# EAGLE schematic smps schematic (EAGLE 9.6.2)
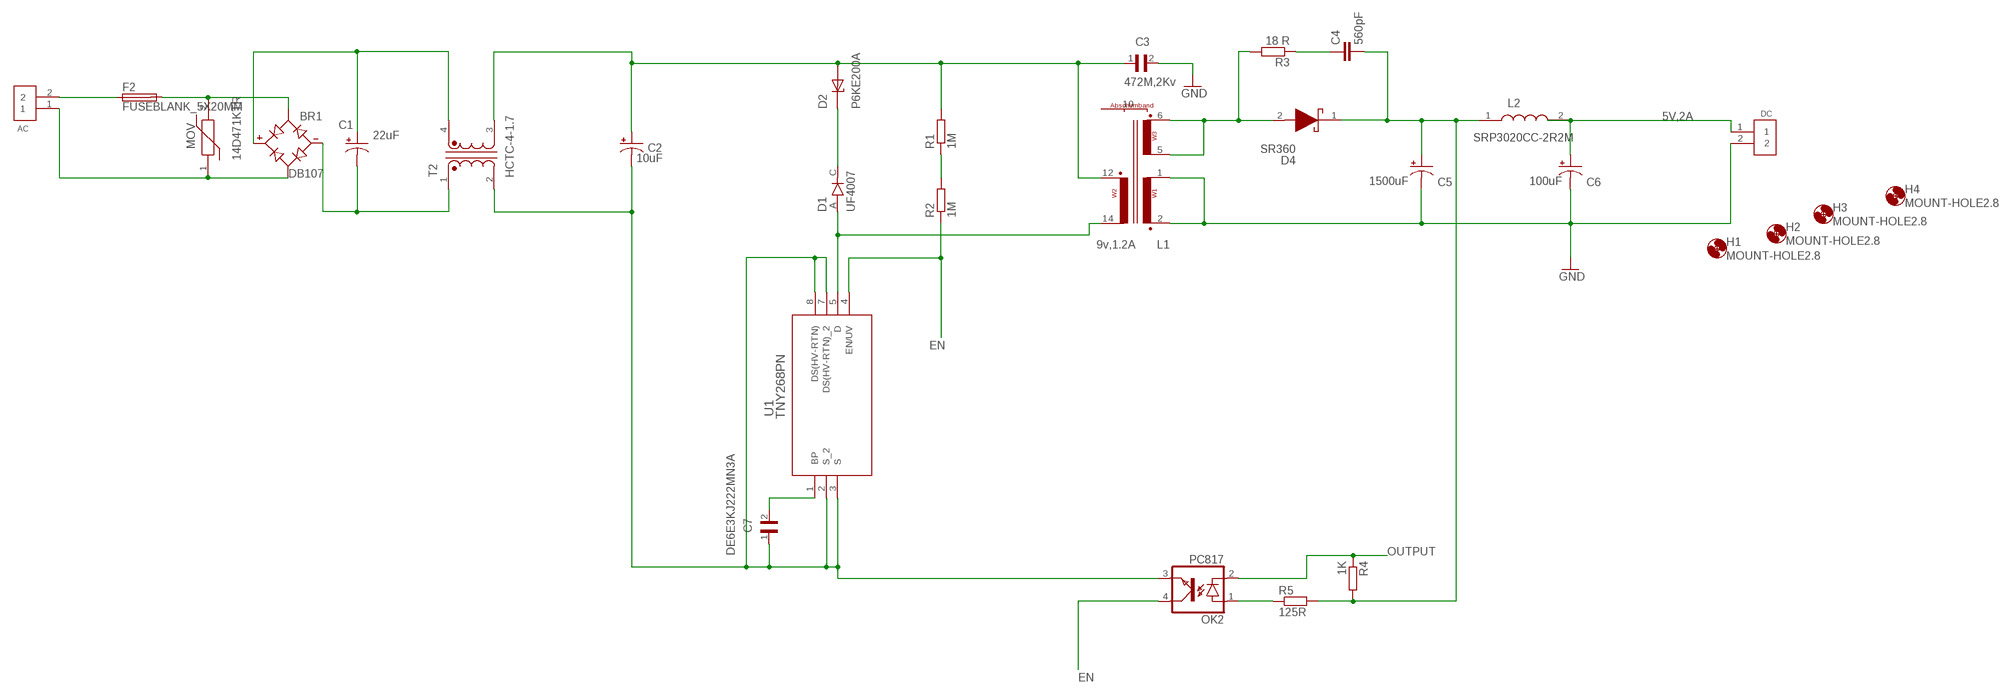
[diagram p0: schematic, sheet 1]

## Parts
AC  282837-2  [TE_282837-2]
BR1  DB107  [DIP825W50P509L880H320Q4]
C1  22uF  1F-2.7V(PTH)CPOL-RADIAL-1H-2.7V  [CPOL-RADIAL-1F-2.7V]
C2  10uF  1F-2.7V(PTH)CPOL-RADIAL-1H-2.7V  [CPOL-RADIAL-1F-2.7V]
C3  472M,2Kv  DE6E3KJ222MN3A  [CAP_DE6E3KJ222MN3A]
C4  560pF  C2,5-3  [C2.5-3]
C5  1500uF  1F-2.7V(PTH)CPOL-RADIAL-1H-2.7V  [CPOL-RADIAL-1F-2.7V]
C6  100uF  1F-2.7V(PTH)CPOL-RADIAL-1H-2.7V  [CPOL-RADIAL-1F-2.7V]
C7  DE6E3KJ222MN3A  [CAP_DE6E3KJ222MN3A]
D1  UF4007  [DIOAD1036W78L520D274]
D2  P6KE200A  [DIOAD1276W78L760D360]
D4  SR360  [DIOAD3020W130L900D530]
DC  282837-2  [TE_282837-2]
F2  FUSEBLANK_5X20MM  [FUSE_HOLDER_5X20MM]
H1  MOUNT-HOLE2.8  [2,8]
H2  MOUNT-HOLE2.8  [2,8]
H3  MOUNT-HOLE2.8  [2,8]
H4  MOUNT-HOLE2.8  [2,8]
L1  9v,1.2A  ST-D2  [ST-D2]
L2  SRP3020CC-2R2M  [INDPM3532X200N]
MOV  14D471KTR  MOV-14D471KTR  [MOV14D471K]
OK2  PC817  [DIL04]
R1  1M  R-EU_0204/7  [0204/7]
R2  1M  R-EU_0204/7  [0204/7]
R3  18 R  R-EU_0204/7  [0204/7]
R4  1K  R-EU_0204/7  [0204/7]
R5  125R  R-EU_0204/7  [0204/7]
T2  HCTC-4-1.7  [XFMR_HCTC-4-1.7]
U1  TNY268PN  [PDIP-8B_P_PWI]

## Nets
5V,2A: C6.+ DC.1 L2.2
EN: OK2.4(COL) R2.1 U1.4(EN/UV)
GND: C3.2 C5.- C6.- DC.2 L1.1(1E) L1.2(1A)
N$1: BR1.1(+) C1.+ T2.4
N$2: BR1.2(-) C1.- T2.1
N$3: AC.2 F2.1
N$4: BR1.3(AC1) F2.2 MOV.2
N$5: AC.1 BR1.4(AC2) MOV.1
N$6: C2.- C7.1 OK2.3(EMIT) T2.2 U1.2(S_2) U1.3(S) U1.7(DS(HV-RTN)_2) U1.8(DS(HV-RTN))
N$7: R1.1 R2.2
N$8: C2.+ C3.1 D2.A L1.12(2A) R1.2 T2.3
N$10: D1.C(K) D2.C
N$11: D1.A L1.14(2E) U1.5(D)
N$12: C7.2 U1.1(BP)
N$14: D4.2(A) L1.5(3E) L1.6(3A) R3.2
N$16: C4.2 C5.+ D4.1(K) L2.1 R4.2 R5.2
N$17: C4.1 R3.1
N$19: OK2.1(A) R5.1
OUTPUT: OK2.2(C) R4.1
Unconnected: L1.10(SCH) L1.13(SCH1)

## Library data of the parts
AC DC = terminal:282837-2: TERM BLOCK 5.08MM 2POS SIDE ENTY Check availability <https://pricing.snapeda.com/parts/282837-2/TE%20Connectivity/view-part?ref=eda>; AVAILABILITY: In Stock; CHECK_PRICES: https://www.snapeda.com/parts/282837-2/TE+Connectivity+AMP+Connectors/view-part/?ref=eda; COMMENT: 282837-2; DESCRIPTION: Terminal Block Connector Wire Receptacle 2 5.08 mm 30-16 AWG Green 13.5 A 250 V | TE Connectivity 282837-2; MF: TE Connectivity; MP: 282837-2; PACKAGE: None; PRICE: None; PURCHASE-URL: https://www.snapeda.com/api/url_track_click_mouser/?unipart_id=2549980&manufacturer=TE Connectivity&part_name=282837-2&search_term=None; SNAPEDA_LINK: https://www.snapeda.com/parts/282837-2/TE+Connectivity+AMP+Connectors/view-part/?ref=snap
BR1 = DB107:DB107: Check availability <https://pricing.snapeda.com/parts/DB107/Rectron%20USA/view-part?ref=eda>; AVAILABILITY: In Stock; CHECK_PRICES: https://www.snapeda.com/parts/DB107/Rectron/view-part/?ref=eda; DESCRIPTION: Bridge Rectifier Single Phase Standard 1 kV Surface Mount DB-S; MF: Rectron USA; MP: DB107; PACKAGE: SMD-4 Rectron; PRICE: None; SNAPEDA_LINK: https://www.snapeda.com/parts/DB107/Rectron/view-part/?ref=snap
C1 C2 C5 C6 = SparkFun-Capacitors:1F-2.7V(PTH): 1F 2.7V SuperCapacitor CAP-14696; PROD_ID: CAP-14696
C3 C7 = DE6E3KJ222MN3A:DE6E3KJ222MN3A: Cap Ceramic Suppression X1/Y2 0.0022uF 300VAC E 20% (9 X 7mm) Radial 7.5mm 125C Automotive Ammo Check availability <https://pricing.snapeda.com/parts/DE6E3KJ222MN3A/Murata%20Electronics/view-part?ref=eda>; AVAILABILITY: In Stock; CHECK_PRICES: https://www.snapeda.com/parts/DE6E3KJ222MN3A/Murata+Electronics+North+America/view-part/?ref=eda; DESCRIPTION: CAPACITOR, X1/Y2, 2.2NF; Capacitor Application:Safety / Suppression; Capacitance:2200pF; Capacitance Tolerance:± 20%; Voltage Rating:300VAC; Capacitor Mounting:Through Hole; Capacitor Terminals:Radial Leaded; Lead Spacing:7.5mm; Operating Temperature Range:-25°C to +85°C; Body Diameter:9mm; External Depth:7mm; MF: Murata Electronics; MP: DE6E3KJ222MN3A; PACKAGE: NONSTANDARD; PRICE: None; PURCHASE-URL: https://www.snapeda.com/api/url_track_click_mouser/?unipart_id=1663590&manufacturer=Murata Electronics&part_name=DE6E3KJ222MN3A&search_term=None; SNAPEDA_LINK: https://www.snapeda.com/parts/DE6E3KJ222MN3A/Murata+Electronics+North+America/view-part/?ref=snap
C4 = capacitor-wima:C: CAPACITOR naming: grid - package width
D1 = UF4007:UF4007: Super Fast Rectifier Diodes Check availability <https://pricing.snapeda.com/parts/UF4007/onsemi/view-part?ref=eda>; AVAILABILITY: In Stock; CHECK_PRICES: https://www.snapeda.com/parts/UF4007/Onsemi/view-part/?ref=eda; DESCRIPTION: Diode Standard 1000 V 1A (DC) Through Hole DO-204AL (DO-41); MF: onsemi; MP: UF4007; PACKAGE: DO-41-2 ONSEMI; PRICE: None; PURCHASE-URL: https://www.snapeda.com/api/url_track_click_mouser/?unipart_id=6596314&manufacturer=onsemi&part_name=UF4007&search_term=None; SNAPEDA_LINK: https://www.snapeda.com/parts/UF4007/Onsemi/view-part/?ref=snap
D2 = P6KE200A:P6KE200A: 274V Clamp 2.2A Ipp Tvs Diode Through Hole DO-204AC (DO-15) Check availability <https://pricing.snapeda.com/parts/P6KE200A/STMicroelectronics/view-part?ref=eda>; AVAILABILITY: In Stock; CHECK_PRICES: https://www.snapeda.com/parts/P6KE200A/STMicroelectronics/view-part/?ref=eda; DESCRIPTION: 353V Clamp 11.3A (8/20µs) Ipp Tvs Diode Through Hole DO-15 (DO-204AC); MF: STMicroelectronics; MP: P6KE200A; PACKAGE: DO-204 STMicroelectronics; PRICE: None; PURCHASE-URL: https://www.snapeda.com/api/url_track_click_mouser/?unipart_id=4834279&manufacturer=STMicroelectronics&part_name=P6KE200A&search_term=None; SNAPEDA_LINK: https://www.snapeda.com/parts/P6KE200A/STMicroelectronics/view-part/?ref=snap
D4 = SR360:SR360: MULTICOMP - SR360 - SCHOTTKY RECTIFIER, 3A, 60V, DO-201AA Source: Datasheet; DESCRIPTION: MULTICOMP - SR360 - SCHOTTKY RECTIFIER, 3A, 60V, DO-201AA; HEIGHT: mm; MANUFACTURER_NAME: Multicomp Pro; MANUFACTURER_PART_NUMBER: SR360
F2 = fuse:FUSE: Fuse; OC_FARNELL: unknown; OC_NEWARK: unknown
H1-H4 = holes:MOUNT-HOLE: MOUNTING HOLE with drill center marker
L1 = trafo-siemens:ST-D2: TRANSFORMER; OC_FARNELL: unknown; OC_NEWARK: unknown
L2 = SRP3020CC-2R2M:SRP3020CC-2R2M: Ind,3.5x3.2x1.8mm,2.2uH+/-20%,3.5A,shd Source: Datasheet <https://www.bourns.com/docs/Product-Datasheets/SRP3020CC.pdf>; DESCRIPTION: Ind,3.5x3.2x1.8mm,2.2uH+/-20%,3.5A,shd; HEIGHT: 2mm; MANUFACTURER_NAME: Bourns; MANUFACTURER_PART_NUMBER: SRP3020CC-2R2M; MOUSER_PART_NUMBER: 652-SRP3020CC-2R2M; MOUSER_PRICE-STOCK: https://www.mouser.co.uk/ProductDetail/Bourns/SRP3020CC-2R2M?qs=1Kr7Jg1SGW95p%2FsB2vUX%252BQ%3D%3D
MOV = MOV-14D471KTR:MOV-14D471KTR: BOURNS - MOV-14D471KTR - VARISTOR, METAL OXIDE, 470V, 14MM, 10% Source: Datasheet <https://www.bourns.com/data/global/pdfs/MOV14D.pdf>; ARROW_PART_NUMBER: MOV-14D471KTR; ARROW_PRICE-STOCK: https://www.arrow.com/en/products/mov-14d471ktr/bourns?region=nac; DESCRIPTION: BOURNS - MOV-14D471KTR - VARISTOR, METAL OXIDE, 470V, 14MM, 10%; HEIGHT: 20mm; MANUFACTURER_NAME: Bourns; MANUFACTURER_PART_NUMBER: MOV-14D471KTR; MOUSER_PART_NUMBER: 652-MOV-14D471KTR; MOUSER_PRICE-STOCK: https://www.mouser.co.uk/ProductDetail/Bourns/MOV-14D471KTR?qs=CQ3B1E%252BbPs0cifVrEP3vgg%3D%3D
OK2 = optocoupler:PC817: SHARP OPTO COUPLER; MPN: PC817X4J000F; OC_FARNELL: 9707727; OC_NEWARK: 97K7059
R1-R5 = rcl:R-EU_: RESISTOR, European symbol; SPICEPREFIX: R
T2 = CMC:HCTC-4-1.7: Check availability <https://pricing.snapeda.com/parts/HCTC-4-1.7/Bel%20Fuse/view-part?ref=eda>; AVAILABILITY: In Stock; CHECK_PRICES: https://www.snapeda.com/parts/HCTC-4-1.7/Bel+Fuse/view-part/?ref=eda; DESCRIPTION: Common Mode Chokes Dual 4000uH 1kHz 1.7A 0.173Ohm DCR Thru-Hole Tray; MF: Bel Fuse; MP: HCTC-4-1.7; PACKAGE: None; PRICE: None; SNAPEDA_LINK: https://www.snapeda.com/parts/HCTC-4-1.7/Bel+Fuse/view-part/?ref=snap
U1 = TNY268PN:TNY268PN: TNY268PN; COPYRIGHT: Copyright (C) 2024 Ultra Librarian. All rights reserved.; MANUFACTURER_PART_NUMBER: TNY268PN; MFR_NAME: Power Integrations